# Altium schematic sheet ALL.SchDoc
size B; SheetNumber: 0; SheetTotal: 0
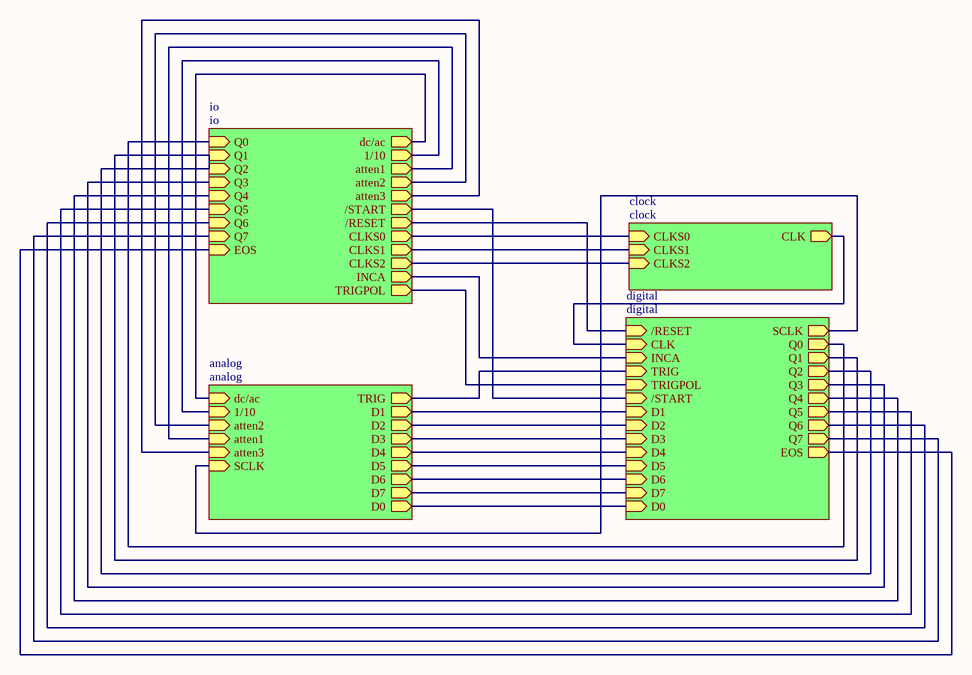
[diagram p0: ALL.SchDoc]

## Sub-sheets
analog = analog: TRIG (out), dc/ac (in), 1/10 (in), atten2 (in), atten1 (in), D1 (out), D2 (out), D3 (out), D4 (out), D5 (out), D6 (out), D7 (out), D0 (out), atten3 (in), SCLK (in)  | Description: analog
clock = clock: CLK (out), CLKS0 (in), CLKS1 (in), CLKS2 (in)  | Description: clock
digital = digital: /RESET (in), CLK (in), INCA (in), SCLK (out), TRIG (in), TRIGPOL (in), /START (in), D1 (in), D2 (in), D3 (in), D4 (in), D5 (in), D6 (in), D7 (in), D0 (in), Q0 (out), Q1 (out), Q2 (out), Q3 (out), Q4 (out), Q5 (out), Q6 (out), Q7 (out), EOS (out)  | Description: digital
io = io: Q0 (in), Q1 (in), Q2 (in), Q3 (in), Q4 (in), Q5 (in), Q6 (in), Q7 (in), dc/ac (out), 1/10 (out), atten1 (out), atten2 (out), atten3 (out), /START (out), /RESET (out), CLKS0 (out), CLKS1 (out), CLKS2 (out), INCA (out), TRIGPOL (out), EOS (in)  | Description: io

## Nets
(unnamed): sheet analog/TRIG, sheet digital/TRIG
(unnamed): sheet analog/dc/ac, sheet io/dc/ac
(unnamed): sheet analog/1/10, sheet io/1/10
(unnamed): sheet analog/atten2, sheet io/atten2
(unnamed): sheet analog/atten1, sheet io/atten1
(unnamed): sheet analog/D1, sheet digital/D1
(unnamed): sheet analog/D2, sheet digital/D2
(unnamed): sheet analog/D3, sheet digital/D3
(unnamed): sheet analog/D4, sheet digital/D4
(unnamed): sheet analog/D5, sheet digital/D5
(unnamed): sheet analog/D6, sheet digital/D6
(unnamed): sheet analog/D7, sheet digital/D7
(unnamed): sheet analog/D0, sheet digital/D0
(unnamed): sheet analog/atten3, sheet io/atten3
(unnamed): sheet analog/SCLK, sheet digital/SCLK
(unnamed): sheet digital//RESET, sheet io//RESET
(unnamed): sheet digital/CLK, sheet clock/CLK
(unnamed): sheet digital/INCA, sheet io/INCA
(unnamed): sheet digital/TRIGPOL, sheet io/TRIGPOL
(unnamed): sheet digital//START, sheet io//START
(unnamed): sheet digital/Q0, sheet io/Q0
(unnamed): sheet digital/Q1, sheet digital/Q2, sheet io/Q1, sheet io/Q2
(unnamed): sheet digital/Q3, sheet io/Q3
(unnamed): sheet digital/Q4, sheet io/Q4
(unnamed): sheet digital/Q5, sheet io/Q5
(unnamed): sheet digital/Q6, sheet io/Q6
(unnamed): sheet digital/Q7, sheet io/Q7
(unnamed): sheet digital/EOS, sheet io/EOS
(unnamed): sheet io/CLKS0, sheet clock/CLKS0
(unnamed): sheet io/CLKS1, sheet clock/CLKS1
(unnamed): sheet io/CLKS2, sheet clock/CLKS2